# EasyEDA schematic SCH_Alchemist_Project_MCU_Circuit_Ver2_2024-12-17.json
TITLE: Sheet_1; REV: 1.0; Date: 2024-10-26; Sheet: 1/1; Company: Your Company
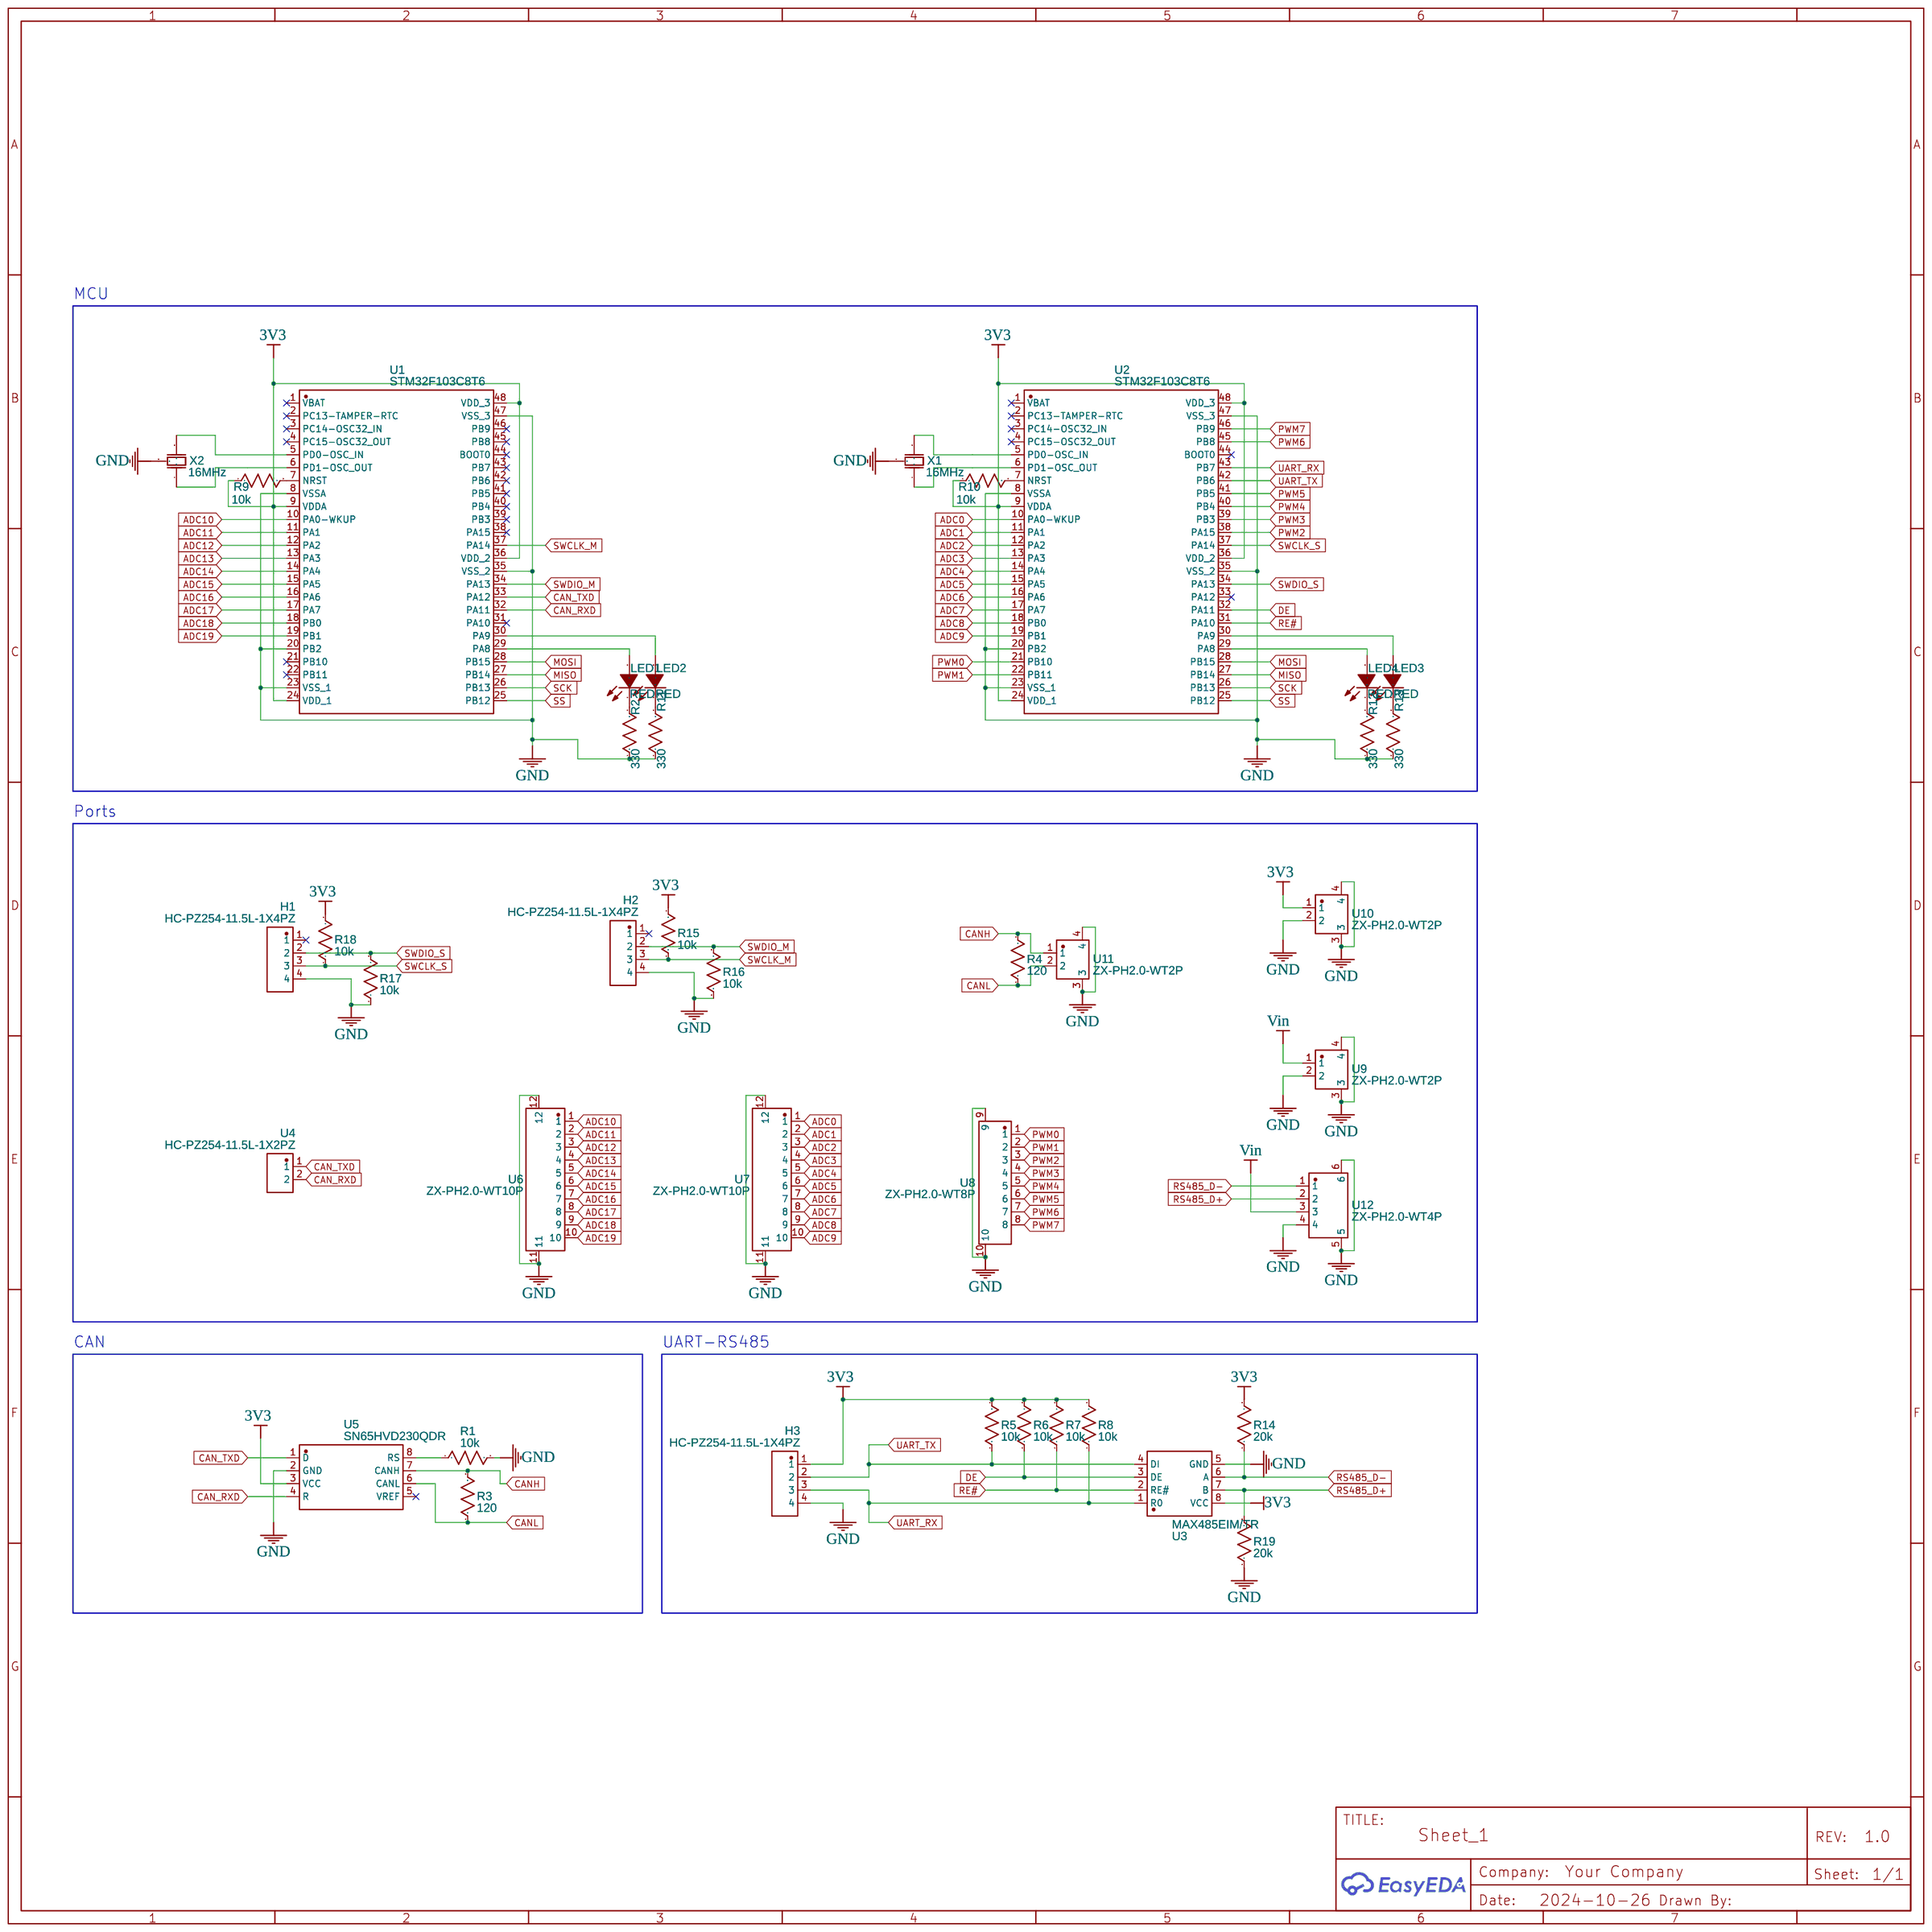
[diagram p0: schematic sheet]

## Parts
H1  HC-PZ254-11.5L-1X4PZ  [HDR-TH_4P-P2.54-V-M]
H2  HC-PZ254-11.5L-1X4PZ  [HDR-TH_4P-P2.54-V-M]
H3  HC-PZ254-11.5L-1X4PZ  [HDR-TH_4P-P2.54-V-M]
LED1  RED  [LED0603-RD]
LED2  RED  [LED0603-RD]
LED3  RED  [LED0603-RD]
LED4  RED  [LED0603-RD]
R1  10k  [R0603]
R2  330  [R0603]
R3  120  [R0603]
R4  120  [R0603]
R5  10k  [R0603]
R6  10k  [R0603]
R7  10k  [R0603]
R8  10k  [R0603]
R9  10k  [R0603]
R10  10k  [R0603]
R11  330  [R0603]
R12  330  [R0603]
R13  330  [R0603]
R14  20k  [R0603]
R15  10k  [R0603]
R16  10k  [R0603]
R17  10k  [R0603]
R18  10k  [R0603]
R19  20k  [R0603]
U1  STM32F103C8T6  [LQFP-48_L7.0-W7.0-P0.50-LS9.0-BL]
U2  STM32F103C8T6  [LQFP-48_L7.0-W7.0-P0.50-LS9.0-BL]
U3  MAX485EIM/TR  [SOP-8_L4.9-W3.9-P1.27-LS6.0-BL]
U4  HC-PZ254-11.5L-1X2PZ  [CONN-TH_HC-PZ254-11.5L-1X2PZ]
U5  SN65HVD230QDR  [SOIC-8_L5.0-W4.0-P1.27-LS6.0-BL]
U6  ZX-PH2.0-WT10P  [CONN-SMD_10P-P2.00_ZX-PH2.0-WT10P]
U7  ZX-PH2.0-WT10P  [CONN-SMD_10P-P2.00_ZX-PH2.0-WT10P]
U8  ZX-PH2.0-WT8P  [CONN-SMD_ZX-PH2.0-WT8P]
U9  ZX-PH2.0-WT2P  [CONN-SMD_ZX-PH2.0-WT2P]
U10  ZX-PH2.0-WT2P  [CONN-SMD_ZX-PH2.0-WT2P]
U11  ZX-PH2.0-WT2P  [CONN-SMD_ZX-PH2.0-WT2P]
U12  ZX-PH2.0-WT4P  [CONN-SMD_4P-P2.00_C2001RS10411M0101RC]
X1  16MHz  [OSC-SMD_3P-L3.2-W1.3-P1.20-L]
X2  16MHz  [OSC-SMD_3P-L3.2-W1.3-P1.20-L]

## Library data of the parts
H1-H3 = HC-PZ254-11.5L-1X4PZ: Supplier: LCSC; Supplier Part: C27985189; Manufacturer: HC(虹成电子); Manufacturer Part: HC-PZ254-11.5L-1x4PZ; Contributor: lcsc; JLCPCB Part Class: Extended Part
LED1-LED4 = KT-0603R: Supplier: LCSC; Manufacturer: KENTO; Supplier Part: C2286; JLCPCB Part Class: Basic Part
R1-R19 = R_0603_US: Contributor: LCEDA_Lib
U1 U2 = STM32F103C8T6: Supplier: LCSC; Manufacturer: ST(意法半导体); Supplier Part: C8734; JLCPCB Part Class: Extended Part
U3 = MAX485EIM/TR: Contributor: LCSC; Supplier: LCSC; Supplier Part: C519080; Manufacturer: HGSEMI(华冠); JLCPCB Part Class: Extended Part
U4 = HC-PZ254-11.5L-1X2PZ: Supplier: LCSC; Supplier Part: C27985187; Manufacturer: HC(虹成电子); Manufacturer Part: HC-PZ254-11.5L-1x2PZ; Contributor: lcsc; JLCPCB Part Class: Extended Part
U5 = SN65HVD230QDR: Contributor: LCSC; Supplier: LCSC; Supplier Part: C16468; Manufacturer: TI(德州仪器); JLCPCB Part Class: Extended Part
U6 U7 = ZX-PH2.0-WT10P: Contributor: lcsc; Supplier: LCSC; Supplier Part: C7429697; Manufacturer: Megastar(兆星); JLCPCB Part Class: Extended Part
U8 = ZX-PH2.0-WT8P: Supplier: LCSC; Supplier Part: C7429695; Manufacturer: Megastar(兆星); JLCPCB Part Class: Extended Part; Contributor: lcsc
U9-U11 = ZX-PH2.0-WT2P: Supplier: LCSC; Supplier Part: C7429689; Manufacturer: Megastar(兆星); JLCPCB Part Class: Extended Part; Contributor: lcsc
U12 = ZX-PH2.0-WT4P: Supplier: LCSC; Supplier Part: C7429691; Manufacturer: Megastar(兆星); JLCPCB Part Class: Extended Part; Contributor: lcsc
X1 X2 = CSTNE16M0V53C000R0: Contributor: LCSC; Supplier: LCSC; Supplier Part: C882606; Manufacturer: muRata(村田); JLCPCB Part Class: Extended Part

## Nets
3V3: H3.1 R5.2 R6.2 R7.2 R8.2 R9.1 R10.1 R14.2 R15.2 R18.2 U1.9(VDDA) U1.24(VDD_1) U1.36(VDD_2) U1.48(VDD_3) U2.9(VDDA) U2.24(VDD_1) U2.36(VDD_2) U2.48(VDD_3) U3.8(VCC) U5.3(VCC) U10.1
GND: H1.4 H2.4 H3.4 R1.2 R2.1 R11.1 R12.1 R13.1 R16.1 R17.1 R19.1 U1.8(VSSA) U1.20(PB2) U1.23(VSS_1) U1.35(VSS_2) U1.47(VSS_3) U2.8(VSSA) U2.20(PB2) U2.23(VSS_1) U2.35(VSS_2) U2.47(VSS_3) U3.5(GND) U5.2(GND) U6.11 U6.12 U7.11 U7.12 U8.9 U8.10 U9.2 U9.3 U9.4 U10.2 U10.3 U10.4 U11.3 U11.4 U12.4 U12.5 U12.6 X1.2(GND) X2.2(GND)
Vin: U9.1 U12.3
ADC0: U2.10(PA0-WKUP) U7.1
ADC1: U2.11(PA1) U7.2
ADC2: U2.12(PA2) U7.3
ADC3: U2.13(PA3) U7.4
ADC4: U2.14(PA4) U7.5
ADC5: U2.15(PA5) U7.6
ADC6: U2.16(PA6) U7.7
ADC7: U2.17(PA7) U7.8
ADC8: U2.18(PB0) U7.9
ADC9: U2.19(PB1) U7.10
ADC10: U1.10(PA0-WKUP) U6.1
ADC11: U1.11(PA1) U6.2
ADC12: U1.12(PA2) U6.3
ADC13: U1.13(PA3) U6.4
ADC14: U1.14(PA4) U6.5
ADC15: U1.15(PA5) U6.6
ADC16: U1.16(PA6) U6.7
ADC17: U1.17(PA7) U6.8
ADC18: U1.18(PB0) U6.9
ADC19: U1.19(PB1) U6.10
CAN_RXD: U1.32(PA11) U4.2 U5.4(R)
CAN_TXD: U1.33(PA12) U4.1 U5.1(D)
CANH: R3.2 R4.2 U5.7(CANH) U11.1
CANL: R3.1 R4.1 U5.6(CANL) U11.2
DE: R6.1 U2.32(PA11) U3.3(DE)
MISO: U1.27(PB14) U2.27(PB14)
MOSI: U1.28(PB15) U2.28(PB15)
PWM0: U2.21(PB10) U8.1
PWM1: U2.22(PB11) U8.2
PWM2: U2.38(PA15) U8.3
PWM3: U2.39(PB3) U8.4
PWM4: U2.40(PB4) U8.5
PWM5: U2.41(PB5) U8.6
PWM6: U2.45(PB8) U8.7
PWM7: U2.46(PB9) U8.8
RE#: R7.1 U2.31(PA10) U3.2(RE#)
RS485_D+: R19.2 U3.7(B) U12.2
RS485_D-: R14.1 U3.6(A) U12.1
SCK: U1.26(PB13) U2.26(PB13)
SS: U1.25(PB12) U2.25(PB12)
SWCLK_M: H2.3 R15.1 U1.37(PA14)
SWCLK_S: H1.3 R18.1 U2.37(PA14)
SWDIO_M: H2.2 R16.2 U1.34(PA13)
SWDIO_S: H1.2 R17.2 U2.34(PA13)
UART_RX: H3.3 R8.1 U2.43(PB7) U3.1(R0)
UART_TX: H3.2 R5.1 U2.42(PB6) U3.4(DI)
Net-(LED1-1): LED1.1(K) R2.2
Net-(LED1-2): LED1.2(A) U1.29(PA8)
Net-(LED2-1): LED2.1(K) R11.2
Net-(LED2-2): LED2.2(A) U1.30(PA9)
Net-(LED3-1): LED3.1(K) R13.2
Net-(LED3-2): LED3.2(A) U2.30(PA9)
Net-(LED4-1): LED4.1(K) R12.2
Net-(LED4-2): LED4.2(A) U2.29(PA8)
Net-(R1-1): R1.1 U5.8(RS)
Net-(R9-2): R9.2 U1.7(NRST)
Net-(R10-2): R10.2 U2.7(NRST)
Net-(U1-5): U1.5(PD0-OSC_IN) X2.3(OSC2)
Net-(U1-6): U1.6(PD1-OSC_OUT) X2.1(OSC1)
Net-(U2-5): U2.5(PD0-OSC_IN) X1.3(OSC2)
Net-(U2-6): U2.6(PD1-OSC_OUT) X1.1(OSC1)

Not connected (* = marked no-connect by the designer): H1 1*; H2 1*; U1 1(VBAT)* 2(PC13-TAMPER-RTC)* 3(PC14-OSC32_IN)* 4(PC15-OSC32_OUT)* 21(PB10)* 22(PB11)* 31(PA10)* 38(PA15)* 39(PB3)* 40(PB4)* 41(PB5)* 42(PB6)* 43(PB7)* 44(BOOT0)* 45(PB8)* 46(PB9)*; U2 1(VBAT)* 2(PC13-TAMPER-RTC)* 3(PC14-OSC32_IN)* 4(PC15-OSC32_OUT)* 33(PA12)* 44(BOOT0)*; U5 5(VREF)*

## Notes on the sheet
- MCU
- Ports
- CAN
- UART-RS485
